# EAGLE design PCB boost converter (EAGLE 9.5.0)
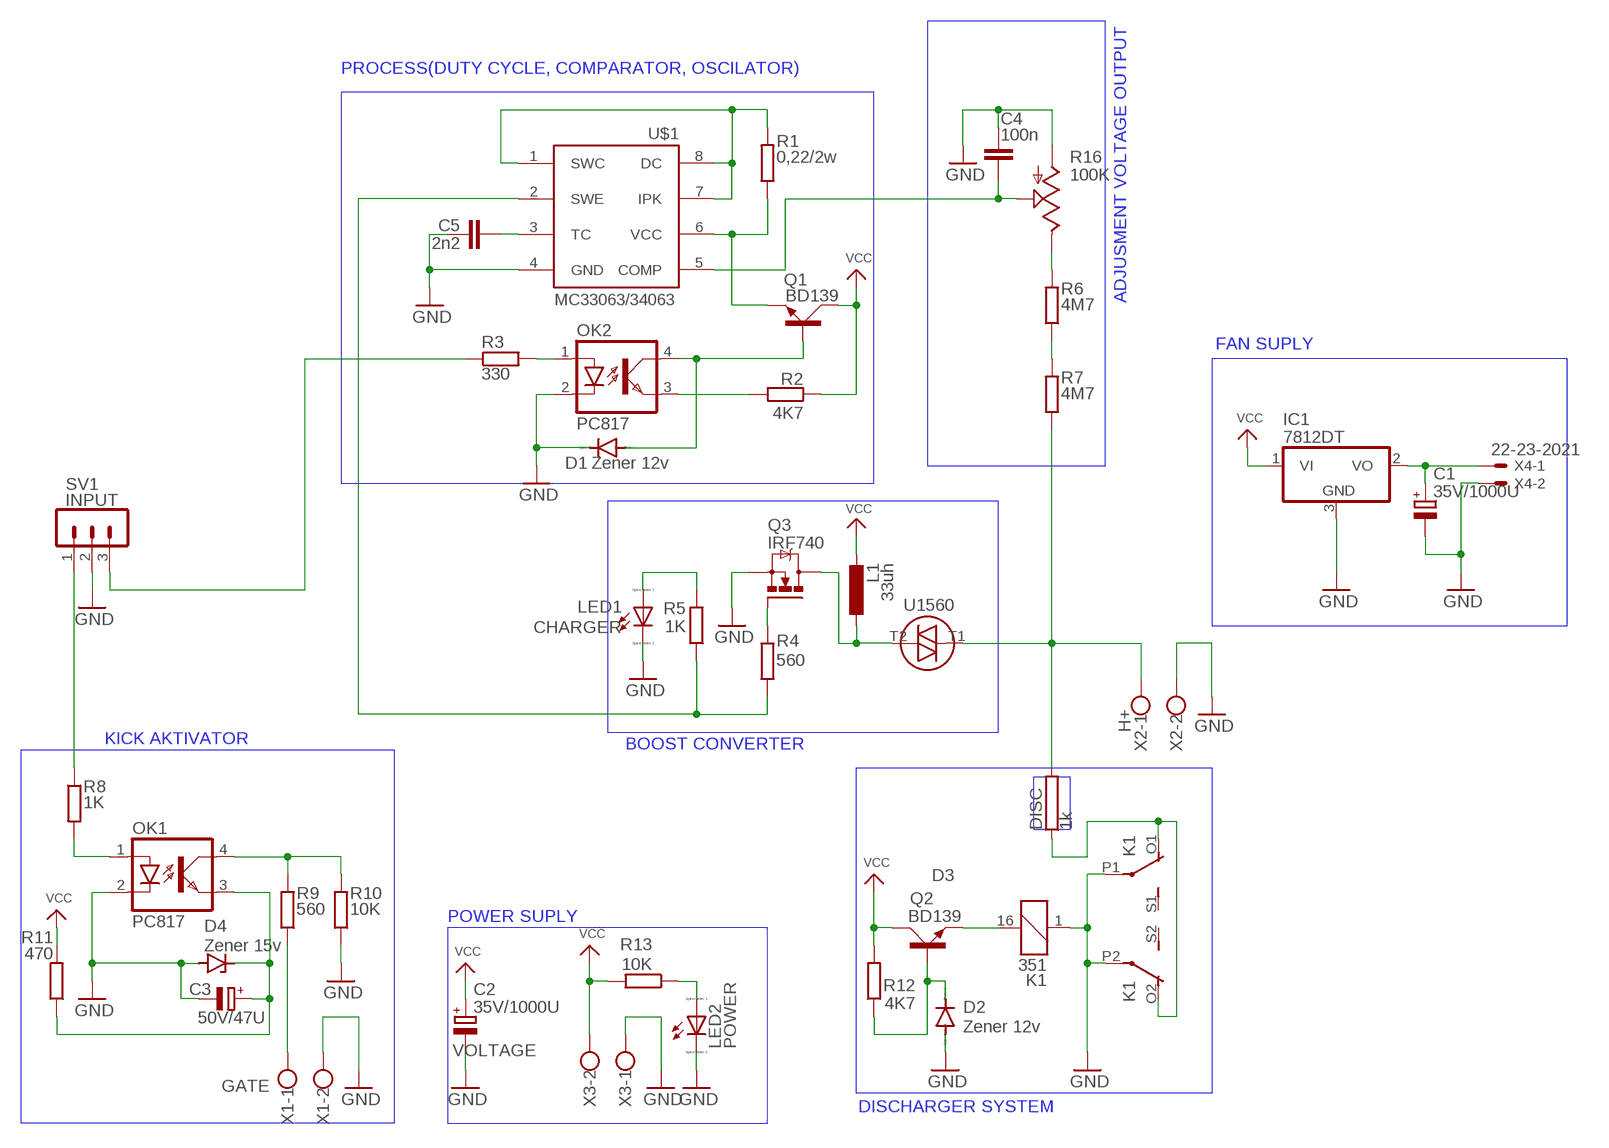
[diagram p0: schematic, sheet 1]

## Parts
C1  35V/1000U  CPOL-EUE2.5-7  [E2,5-7]
C2  35V/1000U  CPOL-EUE2.5-7  [E2,5-7]
C3  50V/47U  CPOL-EU153CLV-0810  [153CLV-0810]
C4  100n  C-EUC0805K  [C0805K]
C5  2n2  C-EUC0805K  [C0805K]
D1  Zener 12v  1N4148DO35-7  [DO35-7]
D2  Zener 12v  1N4148DO35-7  [DO35-7]
D3  U1560  BR210  [BR210S]
D4  Zener 15v  BZX55  [DO35Z10]
DISC  1k  RRWM10X64  [RWM10X64]
IC1  7812DT  [TO252]
K1  351  [351]
L1  33uh  L-EUTJ3-U2  [TJ3-U2]
LED1  CHARGER  LED_E  [LED_1206]
LED2  POWER  LED_E  [LED_1206]
OK1  PC817  [DIL04]
OK2  PC817  [DIL04]
Q1  BD139  [TO126AV]
Q2  BD139  [TO126AV]
Q3  IRF740  [TO220BV]
R1  0,22/2w  R-EU_M1206  [M1206]
R2  4K7  R-EU_M1206  [M1206]
R3  330  R-EU_M1206  [M1206]
R4  560  R-EU_M1206  [M1206]
R5  1K  R-EU_M1206  [M1206]
R6  4M7  R-EU_0309/10  [0309/10]
R7  4M7  R-EU_0309/10  [0309/10]
R8  1K  R-EU_M1206  [M1206]
R9  560  R-EU_M1206  [M1206]
R10  10K  R-EU_M1206  [M1206]
R11  470  R-EU_M1206  [M1206]
R12  4K7  R-EU_M1206  [M1206]
R13  10K  R-EU_M1206  [M1206]
R16  100K  TRIM_US-CA6V  [CA6V]
SV1  INPUT  MA03-1  [MA03-1]
U$1  MC33063/MC34063D  [SO08]
X1  GATE  W237-102  [W237-102]
X2  H+  W237-102  [W237-102]
X3  VOLTAGE  W237-102  [W237-102]
X4  22-23-2021  [22-23-2021]

## Nets
GND: C1.- C2.- C3.- C4.1 C5.1 D1.C D2.A D4.A IC1.3(GND) K1.1 K1.P1(2:P) K1.P2(3:P) LED1.C LED2.C OK1.2(C) OK2.2(C) Q3.S R10.1 R16.A SV1.2 U$1.4(GND) X1.2 X2.2 X3.1 X4.2
N$1: R1.2 U$1.1(SWC) U$1.7(IPK) U$1.8(DC)
N$2: Q1.E R1.1 U$1.6(VCC)
N$3: D1.A OK2.4(COL) Q1.B
N$4: OK2.3(EMIT) R2.2
N$5: R8.1 SV1.1
N$6: OK2.1(A) R3.2
N$7: D3.T2 L1.1 Q3.D
N$8: C4.2 R16.S U$1.5(COMP)
N$9: D3.T1 DISC.2 R7.1 X2.1
N$10: C5.2 U$1.3(TC)
N$11: LED1.A R5.2
N$12: R6.1 R7.2
N$13: Q3.G R4.1
N$14: R3.1 SV1.3
N$15: R6.2 R16.E
N$16: DISC.1 K1.O1(2:O) K1.O2(3:O)
N$17: OK1.1(A) R8.2
N$18: OK1.4(COL) R9.2 R10.2
N$19: K1.16 Q2.E
N$21: C3.+ D4.C OK1.3(EMIT) R11.1
N$22: D2.C Q2.B R12.1
N$23: R9.1 X1.1
N$24: LED2.A R13.1
N$25: R4.2 R5.1 U$1.2(SWE)
N$38: C1.+ IC1.2(VO) X4.1
VCC: C2.+ IC1.1(VI) L1.2 Q1.C Q2.C R2.1 R11.2 R12.2 R13.2 X3.2
Unconnected: K1.S1(2:S) K1.S2(3:S)

## Notes on the sheet
- ADJUSMENT VOLTAGE OUTPUT
- PROCESS(DUTY CYCLE, COMPARATOR, OSCILATOR)
- FAN SUPLY
- KICK AKTIVATOR
- BOOST CONVERTER
- POWER SUPLY
- DISCHARGER SYSTEM

## Library data of the parts
C1-C3 = rcl:CPOL-EU: POLARIZED CAPACITOR, European symbol; SPICEPREFIX: C
C4 C5 = rcl:C-EU: CAPACITOR, European symbol; SPICEPREFIX: C
D1 D2 = diode:1N4148: DIODE high speed (Philips)
D3 = diode:BR210: DIAC
D4 = diode:BZX55: Z DIODE
DISC = resistor-power:R: Power Resitor; OC_FARNELL: unknown; OC_NEWARK: unknown
IC1 = adafruit:78*: Positive VOLTAGE REGULATOR Added bigger pads to the TO-92 package
K1 = relay:351: RELAY 2 x switch, Omron; OC_FARNELL: unknown; OC_NEWARK: unknown
L1 = rcl:L-EU: INDUCTOR, European symbol; SPICEPREFIX: L
LED1 LED2 = eagle-ltspice:LED_E: LED Source: http://www.osram.convergy.de Source: www.luxeon.com Source: www.kingbright.com; SPICEMODEL: NONE; SPICEPREFIX: D; SPICETYPE: diode
OK1 OK2 = optocoupler:PC817: SHARP OPTO COUPLER; MPN: PC817X4J000F; OC_FARNELL: 9707727; OC_NEWARK: 97K7059
Q1 Q2 = transistor-power:BD139: NPN TRANSISTOR
Q3 = transistor-power:IRF740: N-CHANNEL MOS FET
R1-R13 = rcl:R-EU_: RESISTOR, European symbol; SPICEPREFIX: R
R16 = pot:TRIM_US-: POTENTIOMETER
SV1 = con-lstb:MA03-1: PIN HEADER; OC_FARNELL: unknown; OC_NEWARK: unknown
U$1 = adafruit:MC33063/MC34063: MC33063 and MC34063 Basic DC/DC converter with internal power-NPN transistor, 100KHz, 1.5A peak switch current. 3-40 input/output.
X1-X3 = con-wago-500:W237-102: WAGO SCREW CLAMP; MPN: 237-102; OC_FARNELL: unknown; OC_NEWARK: 70K9898
X4 = con-molex:22-23-2021: .100" (2.54mm) Center Header - 2 Pin; MF: MOLEX; MPN: 22-23-2021; OC_FARNELL: 1462926; OC_NEWARK: 25C3832

## Board
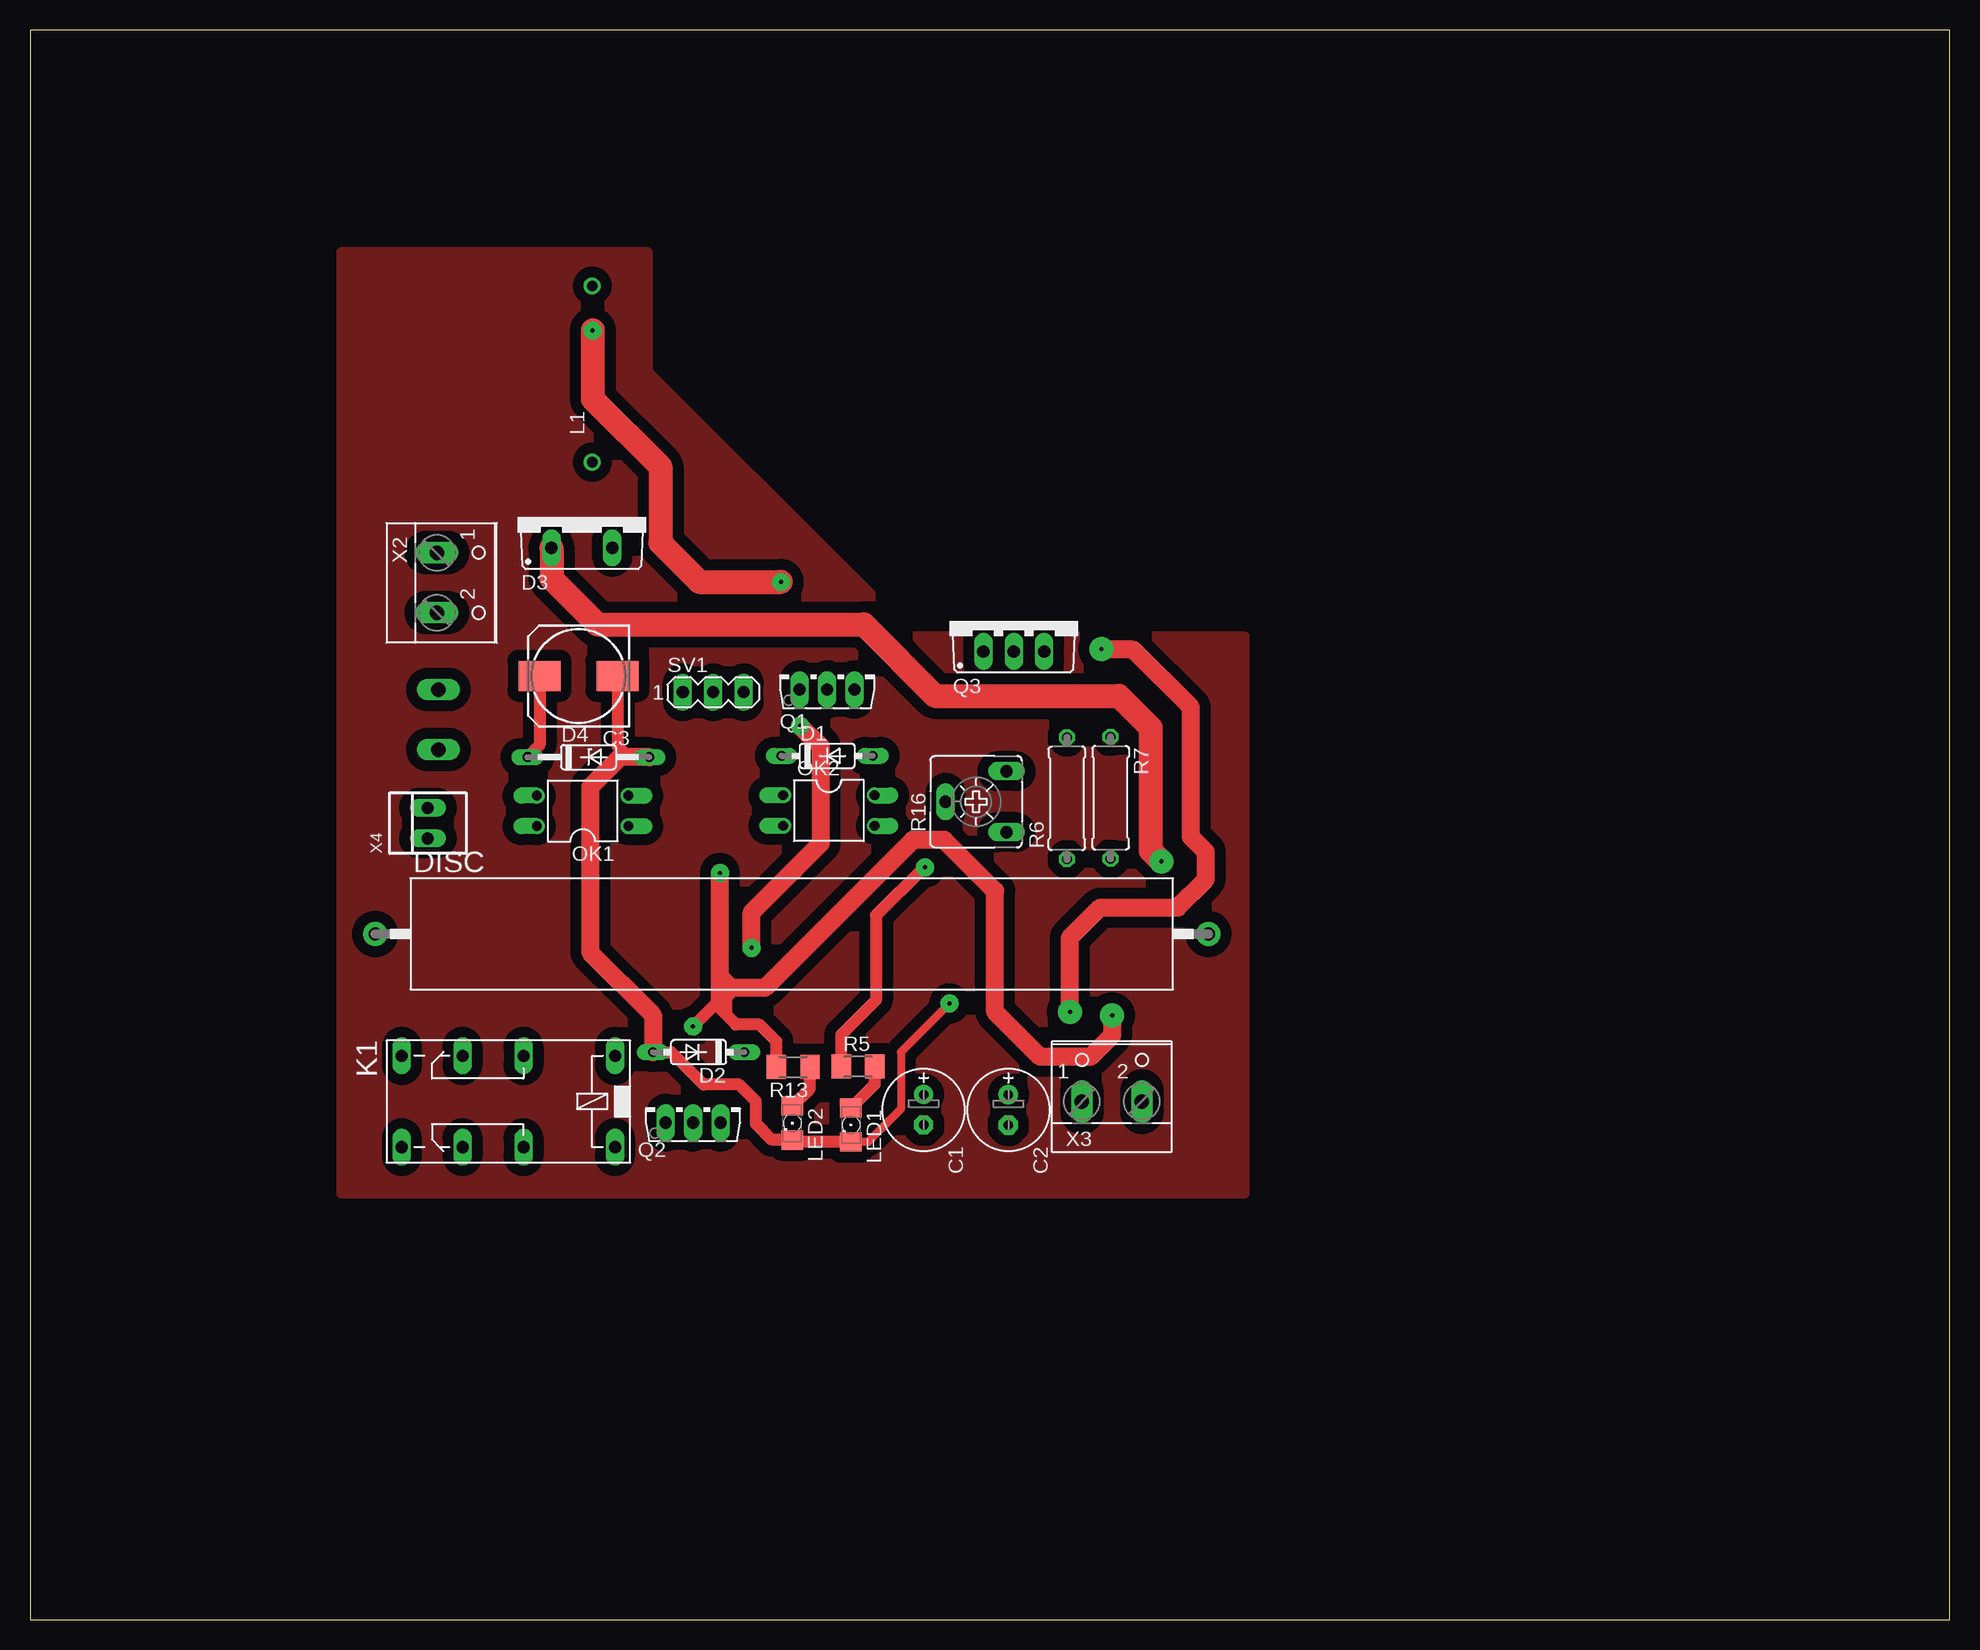
[diagram p1: board, top side]
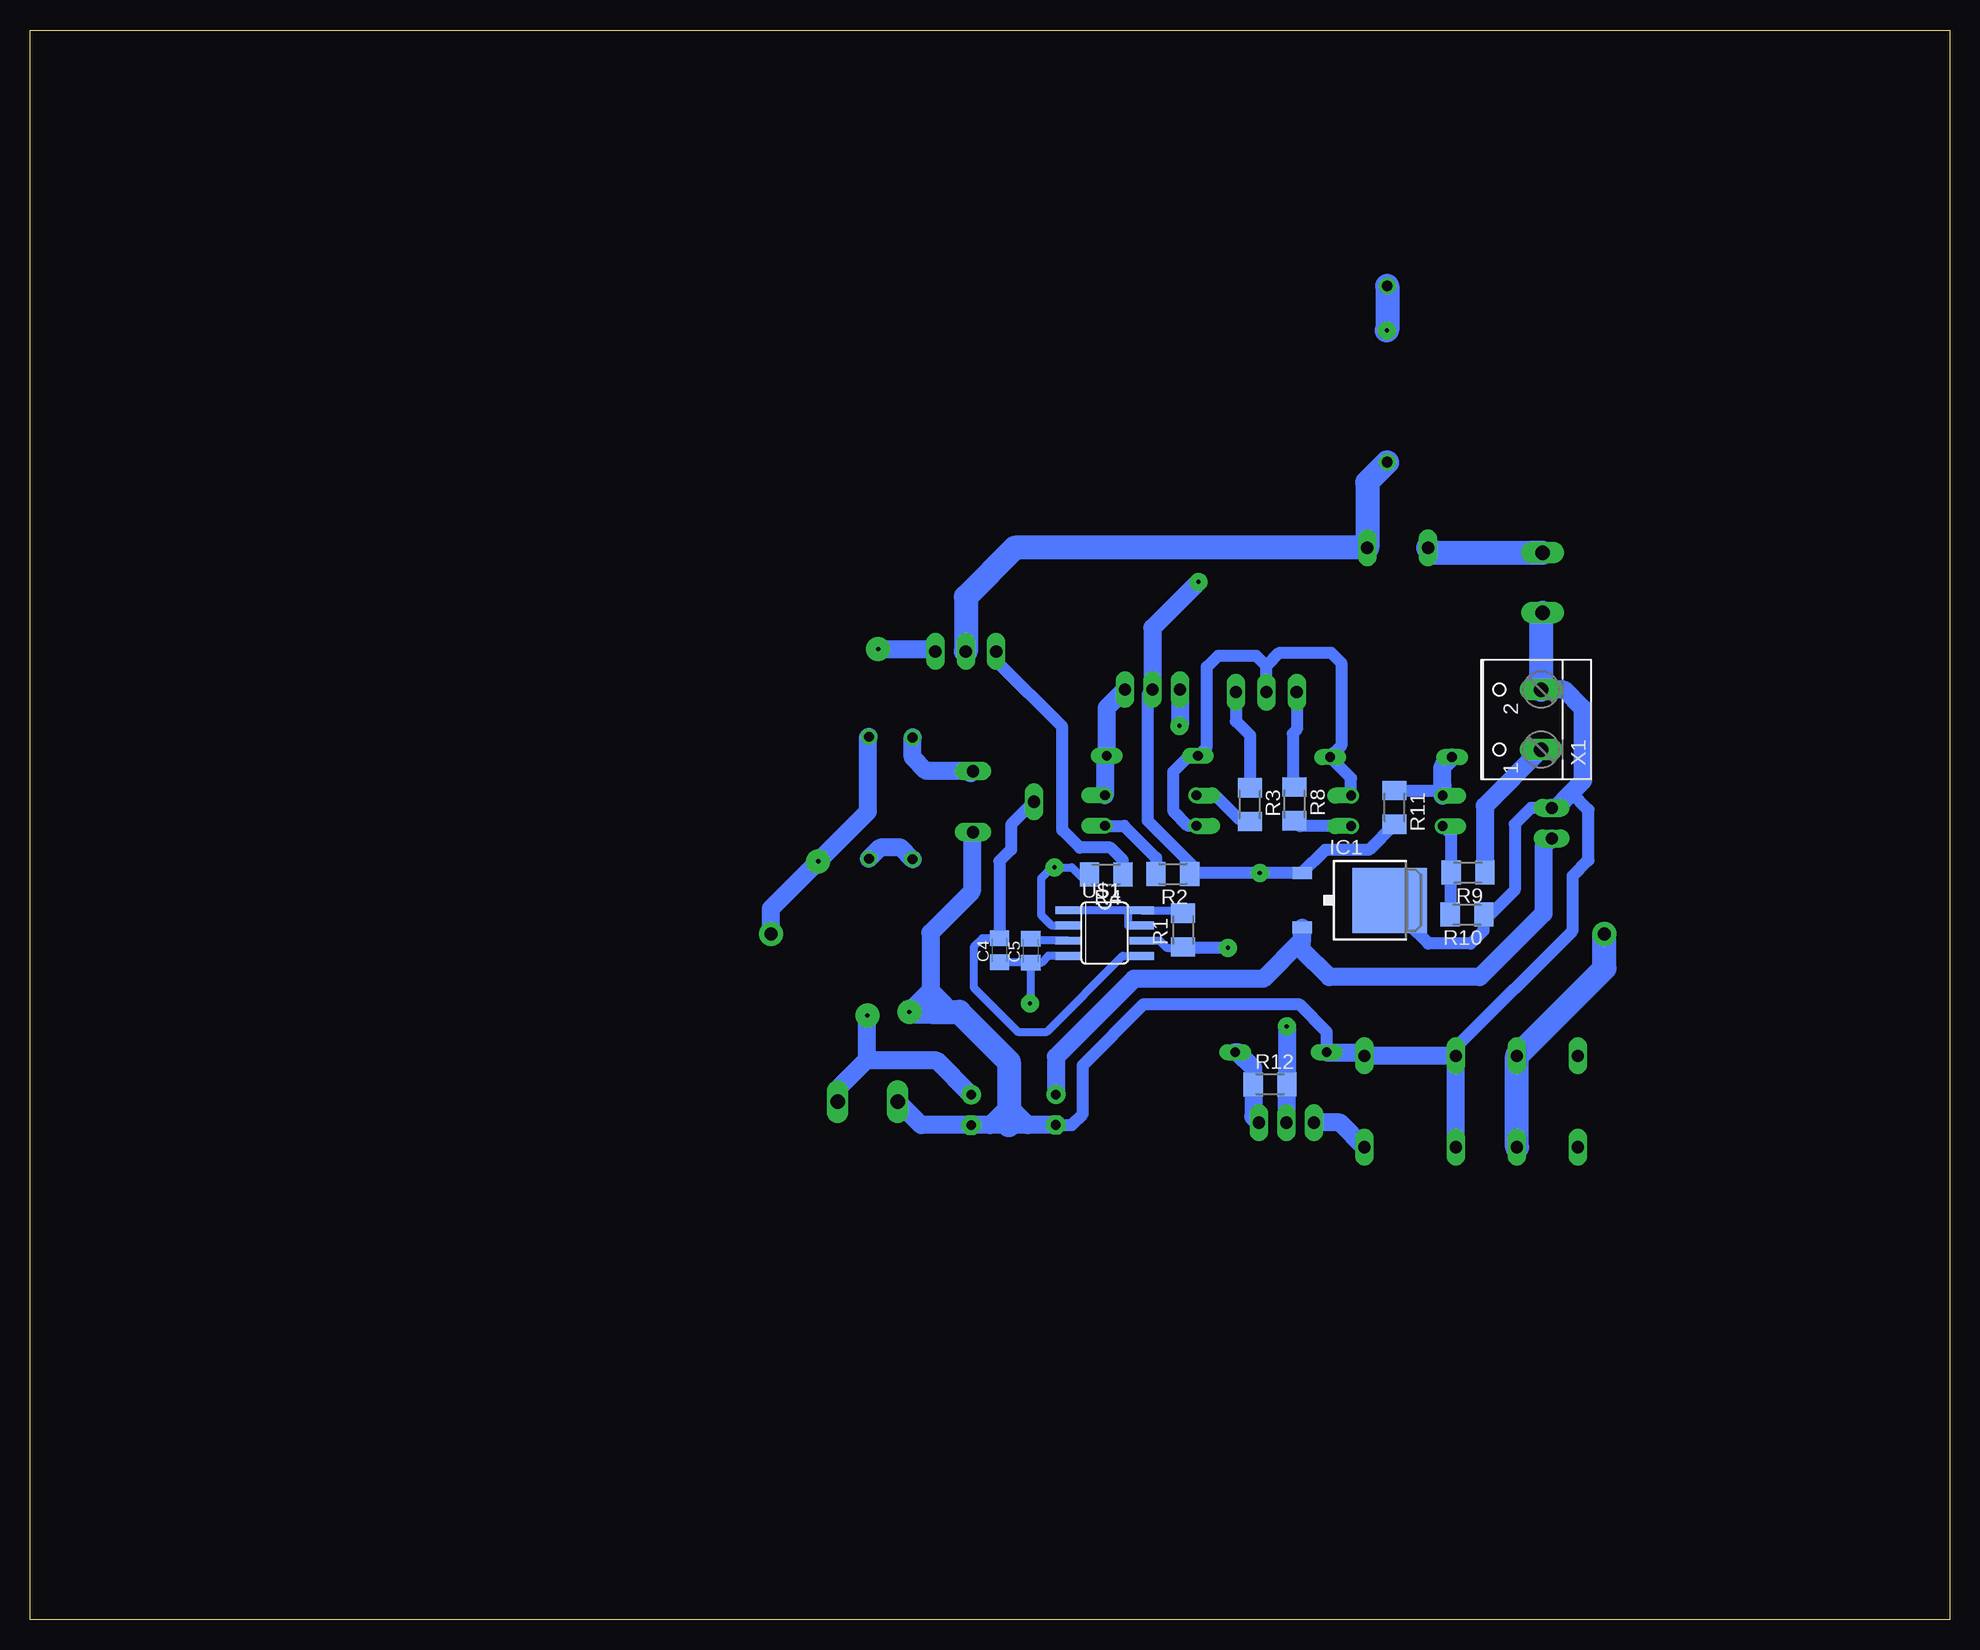
[diagram p2: board, bottom side, seen from below]

Size 160 x 132.5 mm. Coordinates in mm from the lower left corner, seen from the top.
Outline: 0,0 160,0 160,132.5 0,132.5 0,0
Copper layers (1*16): Top 0.035mm / dielectric 1.5mm / Bottom 0.035mm
Design rules "default *": minimum track width 6mil, minimum drill 0.35mm, track to track 36mil, track to pad 36mil, pad to pad 6mil, via to via 6mil, smd to smd 6mil, copper to edge 40mil, drill to drill 6mil, minimum pad ring 10mil, minimum via ring 8mil, stop-mask expansion 4mil, vias tented up to drill 0mil, thermal gap 10mil

### Footprints (pad centres in the part's own frame; a part is rotated, then mirrored left to right if it is on the bottom)
E2,5-7 = drill 0.813 pad 1.6: + -1.27,0 | drill 0.813 pad 1.6 octagon: - 1.27,0
153CLV-0810 = smd 3.5 x 2.5: + 3.25,0; - -3.25,0
C0805K = smd 1.3 x 1.6: 1 -1,0; 2 1,0
DO35-7 = drill 0.813 long: A 3.81,0; C -3.81,0
BR210S = drill 1.016 long: T1 -2.54,-2.54; T2 2.54,-2.54
DO35Z10 = drill 0.813 long: A 5.08,0; C -5.08,0
RWM10X64 = drill 1.1 pad 2: 1 -34.74,0; 2 34.74,0
TO252 = smd 1 x 1.6: 1 -2.28,-4.8; 2 2.28,-4.8 | smd 5.4 x 6.2: 3 0,2.5
351 = drill 1.016 long: 1 -3.81,-3.81; 16 -3.81,3.81; O1 8.89,-3.81; O2 8.89,3.81; P1 3.81,-3.81; P2 3.81,3.81; S1 13.97,-3.81; S2 13.97,3.81
TJ3-U2 = drill 0.9: 1 -7.35,0; 2 7.35,0
LED_1206 = smd 1.6 x 1.803: A -1.422,0; C 1.422,0
DIL04 = drill 0.813 offset: 1 -1.27,-3.81; 2 1.27,-3.81; 3 1.27,3.81; 4 -1.27,3.81
TO126AV = drill 1.016 long: B 2.286,-1.27; C 0,-1.27; E -2.286,-1.27
TO220BV = drill 1.016 long: D 0,-2.54; G -2.54,-2.54; S 2.54,-2.54
M1206 = smd 1.6 x 2: 1 -1.4,0; 2 1.4,0
0309/10 = drill 0.813 octagon: 1 -5.08,0; 2 5.08,0
CA6V = drill 1.016 long: A -2.54,-2.54; E 2.54,-2.54; S 0,2.54
MA03-1 = drill 1.016 long: 1 -2.54,0; 2 0,0; 3 2.54,0
SO08 = smd 0.66 x 2.032: 1 -1.905,-3.073; 2 -0.635,-3.073; 3 0.635,-3.073; 4 1.905,-3.073; 5 1.905,3.073; 6 0.635,3.073; 7 -0.635,3.073; 8 -1.905,3.073
W237-102 = drill 1.194 long: 1 -2.5,-1.27; 2 2.5,-1.27
22-23-2021 = drill 1 long: 1 -1.27,0; 2 1.27,0

### Placement (x,y rotation side)
C1  74.49,42.49 270 top
C2  81.55,42.48 270 top
C3  45.72,78.65 180 top
C4  79.19,55.79 90 bottom
C5  76.59,55.75 90 bottom
D1  66.45,71.99 0 top
D2  55.73,47.29 180 top
D3  46,91.88 0 top
D4  46.55,71.89 0 top
DISC  63.5,57.15 0 top
IC1  49.16,59.95 270 bottom
K1  44.95,43.18 180 top
L1  46.87,103.82 90 top
LED1  68.43,41.23 270 top
LED2  63.54,41.38 270 top
OK1  46.07,67.41 90 top
OK2  66.59,67.43 270 top
Q1  66.44,78.79 0 top
Q2  55.27,42.69 0 top
Q3  82,83.24 0 top
R1  63.89,57.47 90 bottom
R2  64.74,62.16 180 bottom
R3  58.31,67.93 270 bottom
R4  70.3,62.11 180 bottom
R5  69.02,46.09 0 top
R6  86.43,68.45 90 top
R7  90.07,68.5 270 top
R8  54.59,67.99 270 bottom
R9  40.14,62.26 180 bottom
R10  40.22,58.76 180 bottom
R11  46.26,67.7 270 bottom
R12  56.64,44.62 0 bottom
R13  63.61,46.06 180 top
R16  78.86,68.17 90 top
SV1  56.95,77.3 0 top
U$1  70.42,57.22 270 bottom
X1  35.32,75.01 90 bottom
X2  35.18,86.42 270 top
X3  90.17,44.45 0 top
X4  33.16,66.39 90 top

### Tracks (layer width: path | path; a pad name or v marks a point on that pad's centre or on a via)
GND  (via drill 0.35 pad 1.5, 0.35 pad 2)
  Top 0.65: v76.65,51.35 72.6,47.3 72.6,42.55 69.86,39.81 LED1.C
  Top 1: C3.- 48.97,72.83 49.91,71.89 D4.A | LED1.C 63.69,39.81 LED2.C 63.5,40 61.85,40 60.5,41.35 60.5,43.2 59.1,44.6 56.15,44.6 53.46,47.29 D2.A
  Top 1.5: D4.A 49.19,71.89 46.7,69.4 46.7,55.61 51.92,50.39 D2.A | v86.7,50.65 86.7,56.75 86.65,56.8 89.2,59.35 95.65,59.35 98,61.7 98,64 96.75,65.25 96.75,76.05 91.95,80.85 89.35,80.85 v89.3,80.9
  Bottom 0.65: U$1.4 75.14,55.31 75.7,54.75 C5.1 | C5.1 76.63,54.79 C4.1 | C5.1 76.59,51.41 v76.65,51.35
  Bottom 1: IC1.3 45.35,59.95 45.1,59.7 45.1,58 43.45,56.35 39.9,56.35 38.85,57.4 38.85,58.73 R10.1 38.29,58.76 36.25,60.8 36.25,66.3 34.89,67.66 X4.2 | C2.- 85.71,41.22 | OK2.2 63.46,66.16 64.7,67.4 64.7,70.68 63.39,71.99 D1.C 61.9,72.73 61.9,79.4 60.95,80.35 57.8,80.35 56.95,79.5 | SV1.2 56.95,79.5 | 56.95,79.5 55.85,80.6 51.55,80.6 50.7,79.75 50.7,72.82 D4.A 49.88,70.14 OK1.2 | K1.P1 41.14,47.71 31.4,57.45 31.4,62 30.1,63.3 30.1,67.5 31.52,68.92 | C1.- 73.18,41.22 72.25,42.15 72.25,46.2 67.15,51.3 54.25,51.3 51.92,48.97 D2.A
  Bottom 1.5: K1.P2 K1.P1 K1.1 49.06,47.29 D2.A | X4.2 32.79,67.66 31.52,68.92 30.55,69.9 30.55,75.95 32.11,77.51 X1.2 | 76.85,41.22 C1.- 74.41,41.3 | 76.85,41.22 78.4,41.22 79.95,41.22 | 79.95,41.22 C2.- | C2.- 85.71,41.22 X3.1 | R16.A 81.5,65.53 81.5,60.7 84.95,57.25 84.95,52.45 | 84.95,52.45 84.95,50.75 84.85,50.65 | 84.95,52.45 86.7,50.7 v86.7,50.65 | 84.95,52.45 83.8,51.3 83.8,50.65 | 76.85,41.22 78.18,42.55 78.4,42.55 78.62,42.55 79.95,41.22 | v89.3,80.9 84.74,80.9 Q3.S
  Bottom 2: X2.2 34.05,83.78 X1.2 | 78.4,41.22 78.4,42.55 78.4,46.5 82.55,50.65 83.8,50.65 84.85,50.65 v86.7,50.65
N$1
  Bottom 0.65: R1.2 64.14,59.12 U$1.8 68.45,59.12 | 68.45,59.12 U$1.1 | U$1.7 68.44,57.85 68.45,57.85 68.45,59.12
N$2  (via drill 0.35 pad 1.5)
  Top 1.5: v64.2,74.5 65.9,72.8 65.9,64.7 60.15,58.95 v60.15,56
  Bottom 0.65: U$1.6 65.83,56.59 65.25,56 63.96,56 R1.1
  Bottom 1: v60.15,56 63.96,56
  Bottom 1.5: Q1.E 64.15,74.55 v64.2,74.5
N$3
  Bottom 1.5: Q1.B 70.26,75.99 D1.A 70.4,71.85 OK2.4
N$4
  Bottom 1: OK2.3 68.81,66.16 66.14,63.49 R2.2
N$5
  Bottom 1: SV1.1 54.41,74.19 54.75,73.85 54.75,69.56 R8.1
N$6
  Bottom 1: R3.2 58.53,66.75 59.25,66.75 61.2,68.7 OK2.1
N$7
  Bottom 2: Q3.D 82,85.25 77.91,89.34 D3.T2 48.54,94.8 L1.1
N$8
  Bottom 0.65: C4.2 80.61,56.79 81.35,56.05 81.35,52.7 77.65,49 75.25,49 68.94,55.31 U$1.5
  Bottom 1: R16.S 78.22,66.27 78.22,64.18 79.19,63.21 C4.2
N$9  (via drill 0.35 pad 2)
  Top 2: D3.T1 43.46,86.79 47.3,82.95 69.5,82.95 75.45,77 90.75,77 93.4,74.35 93.4,64.1 v94.3,63.2
  Bottom 1.5: R7.1 90.15,73.5 90.15,67.35 v94.3,63.2 98.24,59.26 DISC.2
  Bottom 2: D3.T1 43.04,88.92 X2.1
N$10
  Bottom 0.65: U$1.3 76.42,56.59 C5.2
N$11
  Top 1: LED1.A 70.42,44.64 R5.2
N$12
  Bottom 1.5: R6.1 87.41,64.35 89.14,64.35 R7.2
N$13
  Bottom 1: R4.1 68.9,63.3 69.95,64.35 72.5,64.35 73.95,65.8 73.95,74.4 79.46,79.91 Q3.G
N$14
  Bottom 1: SV1.3 59.49,74.89 58.31,73.71 R3.1
N$15
  Bottom 1.5: 81.58,70.53 R16.E 81.44,70.75 85.3,70.75 86.43,71.88 R6.2
N$16
  Bottom 2: K1.O2 K1.O1 28.76,54.29 DISC.1
N$17
  Bottom 1: OK1.1 54.13,66.14 R8.2
N$18
  Bottom 1: R10.2 41.62,62.18 R9.2 41.54,65.42 OK1.4
N$19
  Bottom 1.5: K1.16 50.81,41.42 Q2.E
N$21
  Top 1: C3.+ 42.47,72.89 D4.C
  Bottom 1: R11.1 42.66,69.1 42.26,69.5
  Bottom 1.5: OK1.3 42.26,69.5 42.26,71.1 D4.C
N$22
  Bottom 1.5: Q2.B 58.04,41.9 R12.1 58.04,45.99 59.34,47.29 D2.C
N$23
  Bottom 1.5: X1.1 38.74,67.82 R9.1
N$24
  Top 1: 63.39,42.95 LED2.A 65.01,44.27 R13.1
N$25  (via drill 0.35 pad 1.5)
  Top 1: R5.1 67.62,48.74 70.52,51.64 70.52,58.67 74.55,62.7 v74.6,62.7
  Bottom 0.65: R4.2 71.91,61.91 72.36,61.91 73.15,62.7 v74.6,62.7 74.8,62.7 75.7,61.8 75.7,58.7 74.86,57.85 U$1.2
N$38
  Bottom 1.5: X4.1 33.85,64.43 33.85,58.85 39.15,53.55 51.7,53.55 53.96,55.81 IC1.2 53.96,56.64 57.2,53.4 68,53.4 74.49,46.91 C1.+
TOP
  pour Top: 26,113.9 26,35.6 101.2,35.6 101.2,81.8 101.25,81.85 73.6,81.85 68.65,86.8 51.45,104 51.45,113.85 51.4,113.9
VCC  (via drill 0.35 pad 1.5, 0.35 pad 2)
  Top 1: 57.5,53.95 58.8,52.65 58.85,52.65 58.05,51.85 | 58.05,51.85 57.65,51.45 57.5,51.45 57.25,51.45 | v55.25,49.45 57.25,51.45 | R13.2 62.21,48.19 60.8,49.6 58.85,49.6 58.05,50.4 | 58.05,50.4 57.25,51.2 57.25,51.45 | 58.05,50.4 58.05,51.85
  Top 1.5: 57.5,51.45 57.5,52.25 | 57.5,52.25 57.5,53.95 v57.5,62.23 | v90.2,50.35 90.2,48.7 88.4,46.9 84.2,46.9 80.45,50.65 80.45,60.75 76.2,65 73.6,65 61.25,52.65 58.85,52.65 57.9,52.65 57.5,52.25
  Top 2: v62.6,86.5 55.8,86.5 52.55,89.75 52.55,96.1 46.9,101.75 v46.9,107.45
  Bottom 1: 63.27,62.23 v57.5,62.23 IC1.1 52.04,64.15 48.41,64.15 R11.2 | 63.27,62.23 R2.1 | Q1.C 66.84,77.12 66.84,66.59 63.27,63.02 63.27,62.23 | 92.67,44.23 X3.2
  Bottom 1.5: Q2.C 55.27,44.59 R12.2 v55.24,49.45 v55.25,49.45 | C2.+ 84.4,46.6 90.3,46.6 | 92.67,44.23 90.3,46.6 | v62.6,86.5 66.44,82.66 Q1.C | 90.3,46.6 90.25,46.65 90.25,50.35 v90.2,50.35
  Bottom 2: L1.2 46.87,107.48 v46.9,107.45